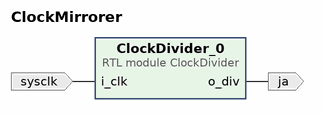
[diagram p0: block diagram of the top level]
# Vivado block design ClockMirrorer, xc7z020clg400-1, Vivado 2021.1
create_bd_design ClockMirrorer

create_bd_port -dir I -type clk sysclk
create_bd_port -dir O ja

create_bd_cell -type module -reference ClockDivider ClockDivider_0

# ---- connections ----

connect_bd_net [get_bd_pins ClockDivider_0/o_div] [get_bd_ports ja]
connect_bd_net -net i_clk_0_1 [get_bd_ports sysclk] [get_bd_pins ClockDivider_0/i_clk]

validate_bd_design
save_bd_design
